# Altium schematic sheet Master.SchDoc
size A4
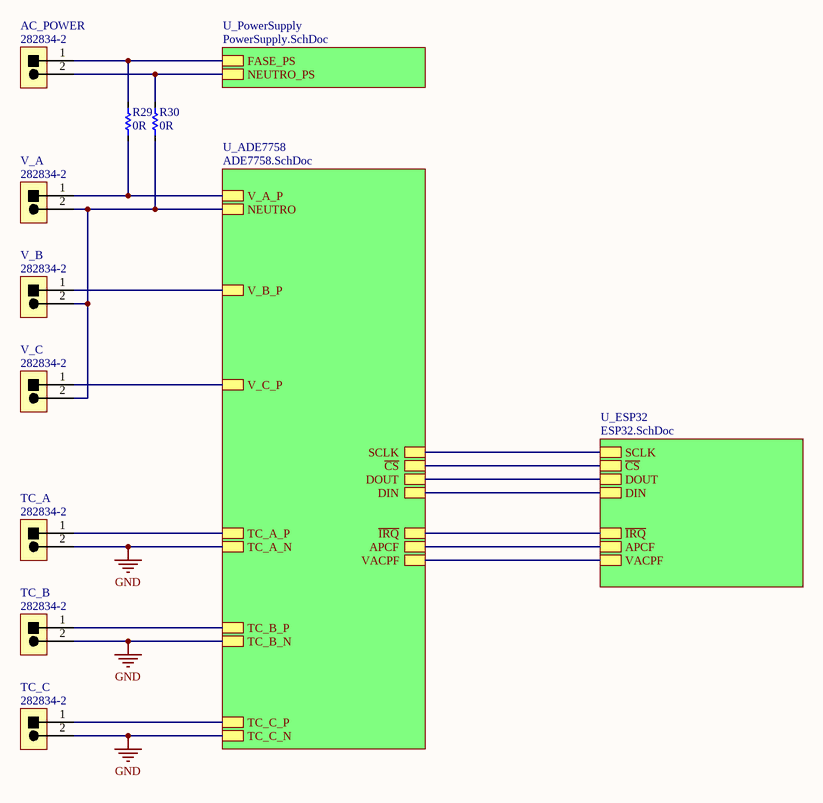
[diagram p0: Master.SchDoc]

## Parts
AC_POWER  Part Number: 282834-2  [TEC_282834-2]  (hidden comment: Conector)
R29  value 0R  [RES0603]  (hidden comment: Resistor)
R30  value 0R  [RES0603]  (hidden comment: Resistor)
TC_A  Part Number: 282834-2  [TEC_282834-2]  (hidden comment: Conector)
TC_B  Part Number: 282834-2  [TEC_282834-2]  (hidden comment: Conector)
TC_C  Part Number: 282834-2  [TEC_282834-2]  (hidden comment: Conector)
V_A  Part Number: 282834-2  [TEC_282834-2]  (hidden comment: Conector)
V_B  Part Number: 282834-2  [TEC_282834-2]  (hidden comment: Conector)
V_C  Part Number: 282834-2  [TEC_282834-2]  (hidden comment: Conector)

## Sub-sheets
U_ADE7758 = ADE7758.SchDoc: TC_A_P, TC_A_N, TC_B_P, TC_B_N, TC_C_P, TC_C_N, V_A_P, V_B_P, V_C_P, NEUTRO, SCLK, ~{CS}, DOUT, DIN, ~{IRQ}, APCF, VACPF
U_ESP32 = ESP32.SchDoc: SCLK, ~{CS}, DOUT, DIN, ~{IRQ}, APCF, VACPF
U_PowerSupply = PowerSupply.SchDoc: FASE_PS, NEUTRO_PS

## Nets
GND: TC_A.2 TC_B.2 TC_C.2 ; sheet U_ADE7758/TC_A_N, sheet U_ADE7758/TC_B_N, sheet U_ADE7758/TC_C_N
NetAC_POWER_1: AC_POWER.1 R29.1 ; sheet U_PowerSupply/FASE_PS
NetAC_POWER_2: AC_POWER.2 R30.1 ; sheet U_PowerSupply/NEUTRO_PS
NetR29_2: R29.2 V_A.1 ; sheet U_ADE7758/V_A_P
NetR30_2: R30.2 V_A.2 V_B.2 V_C.2 ; sheet U_ADE7758/NEUTRO
NetTC_A_1: TC_A.1 ; sheet U_ADE7758/TC_A_P
NetTC_B_1: TC_B.1 ; sheet U_ADE7758/TC_B_P
NetTC_C_1: TC_C.1 ; sheet U_ADE7758/TC_C_P
NetV_B_1: V_B.1 ; sheet U_ADE7758/V_B_P
NetV_C_1: V_C.1 ; sheet U_ADE7758/V_C_P
(unnamed): sheet U_ADE7758/SCLK, sheet U_ESP32/SCLK
(unnamed): sheet U_ADE7758/~{CS}, sheet U_ESP32/~{CS}
(unnamed): sheet U_ADE7758/DOUT, sheet U_ESP32/DOUT
(unnamed): sheet U_ADE7758/DIN, sheet U_ESP32/DIN
(unnamed): sheet U_ADE7758/~{IRQ}, sheet U_ESP32/~{IRQ}
(unnamed): sheet U_ADE7758/APCF, sheet U_ESP32/APCF
(unnamed): sheet U_ADE7758/VACPF, sheet U_ESP32/VACPF

## Library data of the parts
AC_POWER TC_A TC_B TC_C V_A V_B V_C = Conector 2x1: TERM BLOCK 2POS SIDE ENT 2.54MM; Manufacturer: TE Connectivity AMP Connectors; Value: -; PCB Info: -